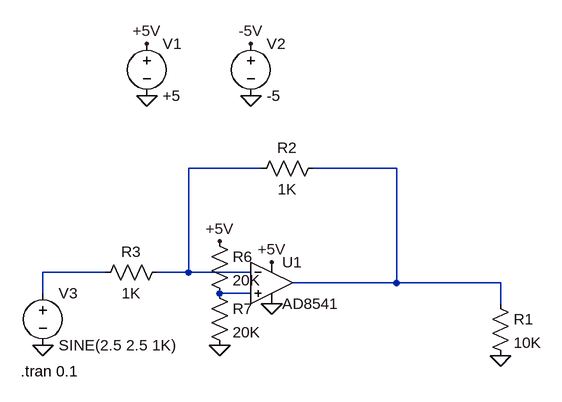
[diagram p0: schematic oscilator.asc]
oscilator.asc, the LTspice schematic file:
Version 4
SHEET 1 880 680
WIRE 192 -16 80 -16
WIRE 400 -16 272 -16
WIRE -48 144 -144 144
WIRE 80 144 80 -16
WIRE 80 144 32 144
WIRE 176 144 80 144
WIRE 400 160 400 -16
WIRE 400 160 240 160
WIRE 560 160 400 160
WIRE -144 176 -144 144
WIRE 176 176 128 176
WIRE 560 192 560 160
FLAG 16 -128 0
FLAG 176 -128 0
FLAG 16 -208 +5V
FLAG 208 128 +5V
FLAG 176 -208 -5V
FLAG -144 256 0
FLAG 560 272 0
FLAG 208 192 0
FLAG 128 96 +5V
FLAG 128 256 0
SYMBOL Opamps\\AD8541 208 96 R0
SYMATTR InstName U1
SYMBOL voltage 16 -224 R0
WINDOW 123 0 0 Left 0
WINDOW 39 0 0 Left 0
SYMATTR InstName V1
SYMATTR Value +5
SYMBOL voltage 176 -224 R0
WINDOW 123 0 0 Left 0
WINDOW 39 0 0 Left 0
SYMATTR InstName V2
SYMATTR Value -5
SYMBOL voltage -144 160 R0
WINDOW 123 0 0 Left 0
WINDOW 39 0 0 Left 0
SYMATTR InstName V3
SYMATTR Value SINE(2.5 2.5 1K)
SYMBOL res 544 176 R0
SYMATTR InstName R1
SYMATTR Value 10K
SYMBOL res 288 -32 R90
WINDOW 0 0 56 VBottom 2
WINDOW 3 32 56 VTop 2
SYMATTR InstName R2
SYMATTR Value 1K
SYMBOL res 48 128 R90
WINDOW 0 0 56 VBottom 2
WINDOW 3 32 56 VTop 2
SYMATTR InstName R3
SYMATTR Value 1K
SYMBOL res 112 80 R0
SYMATTR InstName R6
SYMATTR Value 20K
SYMBOL res 112 160 R0
SYMATTR InstName R7
SYMATTR Value 20K
TEXT -178 296 Left 2 !.tran 0.1

The netlist it stands for:
* oscilator.asc
XU1 N004 N001 +5V 0 N002 AD8541  ; pins In+ In- V+ V- OUT
V1 +5V 0 +5
V2 -5V 0 -5
V3 N003 0 SINE(2.5 2.5 1K)
R1 N002 0 10K
R2 N002 N001 1K
R3 N001 N003 1K
R6 +5V N004 20K
R7 N004 0 20K
.tran 0.1
.backanno
.end